# Altium schematic sheet SAM_E54_Xplained_Pro_TopLevel.SchDoc: Top Level Schematics
size A3; Organization: Microchip Norway; Address1: Vestre Rosten 79; Address2: N-7075 TILLER; Address3: NORWAY; DocumentNumber: A09-2748; Revision: 5; SheetNumber: 1; SheetTotal: 13; DrawnBy: Microchip Norway; Engineer: HN; PageSetup: Record=PageOptions|CenterHorizontal=True|CenterVertical=True|PrintScale=1.01|XCorrection=1.00|YCorrection=1.00|PrintKind=1|BorderSize=5000000|LeftOffset=0|BottomOffset=0|Orientation=2|PaperLength=1000|PaperWidth=1000|Scale=100|PaperSource=7|PrintQuality=-4|MediaType=1|DitherType=10|PaperKind=Letter|PrintScaleMode=1; PCBNumber: A08-2643; PCBRevision: 3; ProjectTitle: SAM E54 Xplained Pro; ProjectName: SAM E54 Xplained Pro
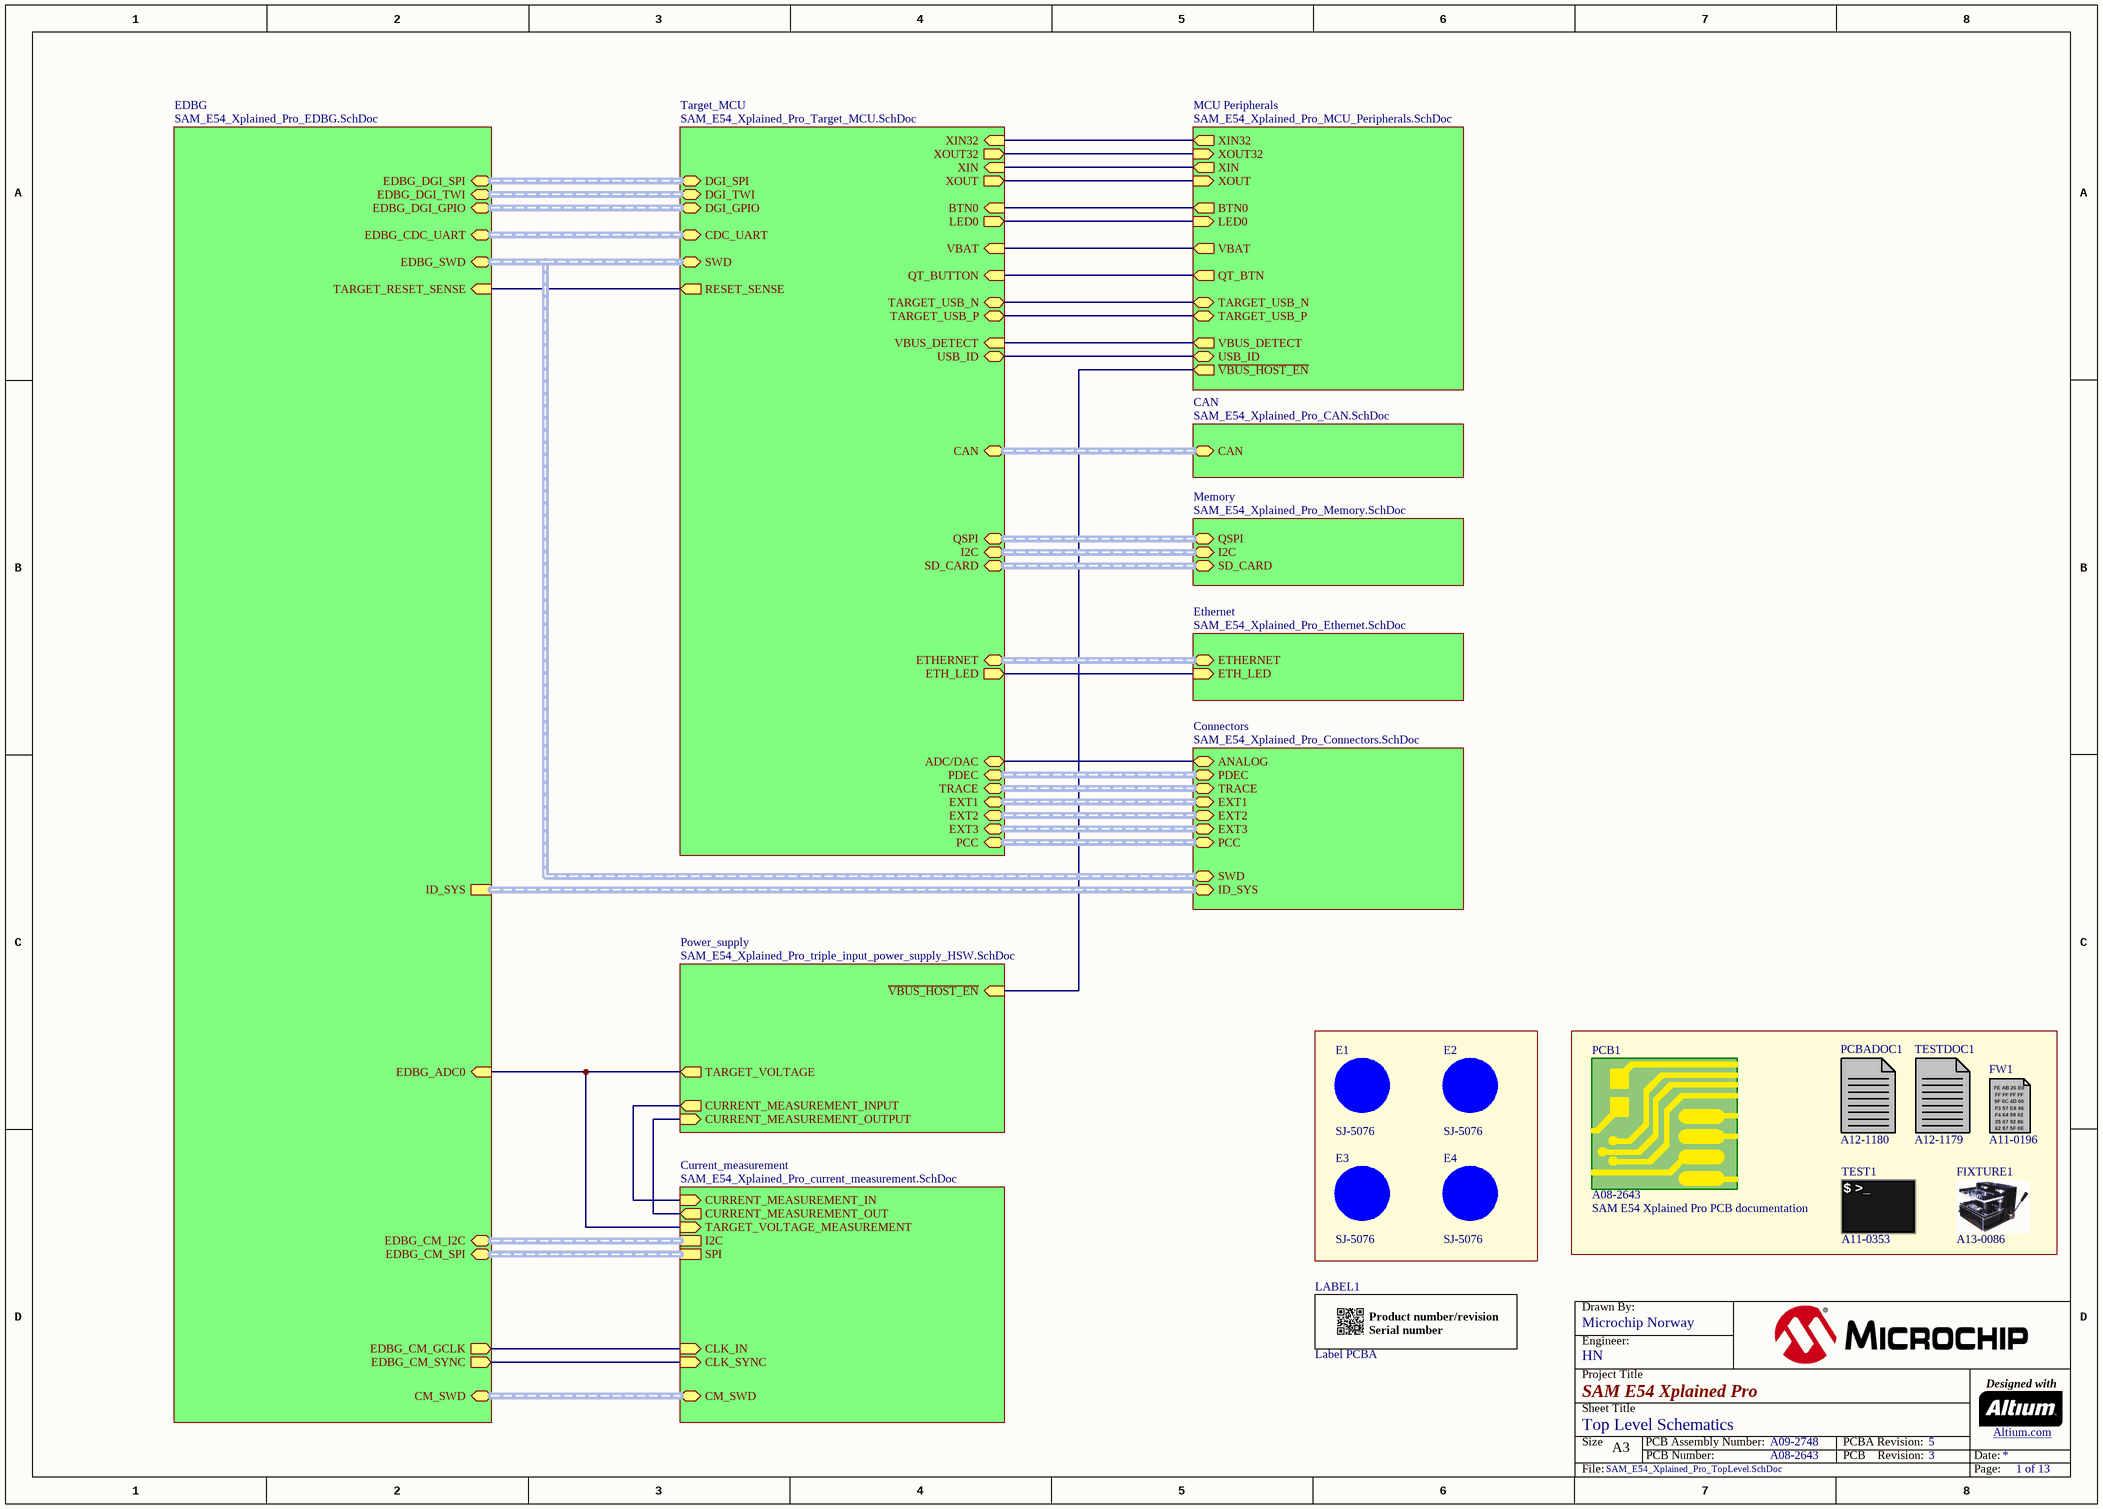
[diagram p0: SAM_E54_Xplained_Pro_TopLevel.SchDoc]

## Parts
E1  value SJ-5076  [AP8-00192]
E2  value SJ-5076  [AP8-00192]
E3  value SJ-5076  [AP8-00192]
E4  value SJ-5076  [AP8-00192]
FIXTURE1  AN: A13-0086  (mechanical)
FW1  AN: A11-0196  (mechanical)
LABEL1  value Label PCBA  [AP8-00317]  (hidden comment: *)
PCB1  value SAM E54 Xplained Pro PCB documentation  AN: A08-2643  (mechanical)
PCBADOC1  AN: A12-1180  (mechanical)
TEST1  AN: A11-0353  (mechanical)
TESTDOC1  AN: A12-1179  (mechanical)

## Sub-sheets
CAN = SAM_E54_Xplained_Pro_CAN.SchDoc: CAN (harness CAN)
Connectors = SAM_E54_Xplained_Pro_Connectors.SchDoc: EXT1 (harness EXT), EXT3 (harness EXT), SWD (harness SWD), ID_SYS (harness ID_SYS), EXT2 (harness EXT), TRACE (harness TRACE), PCC (harness PCC), PDEC (harness PDEC), ANALOG (bidir)
Current_measurement = SAM_E54_Xplained_Pro_current_measurement.SchDoc: I2C (harness I2C), SPI (harness SPI), CLK_IN (in), CLK_SYNC (in), CURRENT_MEASUREMENT_OUT (out), CURRENT_MEASUREMENT_IN (in), TARGET_VOLTAGE_MEASUREMENT (in), CM_SWD (harness SWD)
EDBG = SAM_E54_Xplained_Pro_EDBG.SchDoc: ID_SYS (harness ID_SYS), EDBG_CDC_UART (harness UART), EDBG_DGI_TWI (harness I2C), EDBG_DGI_SPI (harness SPI), TARGET_RESET_SENSE (in), EDBG_ADC0 (in), EDBG_CM_I2C (harness I2C), EDBG_CM_SPI (harness SPI), EDBG_CM_GCLK (out), EDBG_CM_SYNC (out), CM_SWD (harness SWD), EDBG_SWD (harness SWD), EDBG_DGI_GPIO (harness GPIO)
Ethernet = SAM_E54_Xplained_Pro_Ethernet.SchDoc: ETHERNET (harness ETHERNET), ETH_LED (in)
MCU Peripherals = SAM_E54_Xplained_Pro_MCU_Peripherals.SchDoc: VBUS_DETECT (out), XIN32 (out), XIN (out), XOUT32 (in), TARGET_USB_N (bidir), TARGET_USB_P (bidir), BTN0 (out), LED0 (in), XOUT (in), ~{VBUS_HOST_EN} (out), VBAT (out), USB_ID (bidir), QT_BTN (out)
Memory = SAM_E54_Xplained_Pro_Memory.SchDoc: QSPI (harness QSPI), I2C (harness I2C), SD_CARD (harness SD_CARD)
Power_supply = SAM_E54_Xplained_Pro_triple_input_power_supply_HSW.SchDoc: TARGET_VOLTAGE (out), CURRENT_MEASUREMENT_INPUT (out), CURRENT_MEASUREMENT_OUTPUT (in), ~{VBUS_HOST_EN} (in)
Target_MCU = SAM_E54_Xplained_Pro_Target_MCU.SchDoc: DGI_SPI (harness SPI), DGI_TWI (harness I2C), CDC_UART (harness UART), EXT3 (harness EXT), EXT1 (harness EXT), RESET_SENSE (out), SWD (harness SWD), EXT2 (harness EXT), CAN (harness CAN), QSPI (harness QSPI), I2C (harness I2C), SD_CARD (harness SD_CARD), ETHERNET (harness ETHERNET), VBUS_DETECT (in), XIN32 (in), XIN (in), XOUT32 (out), TARGET_USB_N (bidir), TARGET_USB_P (bidir), BTN0 (in), LED0 (out), XOUT (out), USB_ID (bidir), VBAT (in), TRACE (harness TRACE), PCC (harness PCC), ETH_LED (out), DGI_GPIO (harness GPIO), QT_BUTTON (in), PDEC (harness PDEC), ADC/DAC (bidir)

## Nets
(unnamed): sheet Target_MCU/RESET_SENSE, sheet EDBG/TARGET_RESET_SENSE
(unnamed): sheet Target_MCU/VBUS_DETECT, sheet MCU Peripherals/VBUS_DETECT
(unnamed): sheet Target_MCU/XIN32, sheet MCU Peripherals/XIN32
(unnamed): sheet Target_MCU/XIN, sheet MCU Peripherals/XIN
(unnamed): sheet Target_MCU/XOUT32, sheet MCU Peripherals/XOUT32
(unnamed): sheet Target_MCU/TARGET_USB_N, sheet MCU Peripherals/TARGET_USB_N
(unnamed): sheet Target_MCU/TARGET_USB_P, sheet MCU Peripherals/TARGET_USB_P
(unnamed): sheet Target_MCU/BTN0, sheet MCU Peripherals/BTN0
(unnamed): sheet Target_MCU/LED0, sheet MCU Peripherals/LED0
(unnamed): sheet Target_MCU/XOUT, sheet MCU Peripherals/XOUT
(unnamed): sheet Target_MCU/USB_ID, sheet MCU Peripherals/USB_ID
(unnamed): sheet Target_MCU/VBAT, sheet MCU Peripherals/VBAT
(unnamed): sheet Target_MCU/ETH_LED, sheet Ethernet/ETH_LED
(unnamed): sheet Target_MCU/QT_BUTTON, sheet MCU Peripherals/QT_BTN
(unnamed): sheet Target_MCU/ADC/DAC, sheet Connectors/ANALOG
(unnamed): sheet EDBG/EDBG_ADC0, sheet Power_supply/TARGET_VOLTAGE, sheet Current_measurement/TARGET_VOLTAGE_MEASUREMENT
(unnamed): sheet EDBG/EDBG_CM_GCLK, sheet Current_measurement/CLK_IN
(unnamed): sheet EDBG/EDBG_CM_SYNC, sheet Current_measurement/CLK_SYNC
(unnamed): sheet Power_supply/CURRENT_MEASUREMENT_INPUT, sheet Current_measurement/CURRENT_MEASUREMENT_IN
(unnamed): sheet Power_supply/CURRENT_MEASUREMENT_OUTPUT, sheet Current_measurement/CURRENT_MEASUREMENT_OUT
(unnamed): sheet Power_supply/~{VBUS_HOST_EN}, sheet MCU Peripherals/~{VBUS_HOST_EN}

Not connected (* = marked no-connect by the designer): E1 1(FIDUCIAL); E2 1(FIDUCIAL); E3 1(FIDUCIAL); E4 1(FIDUCIAL)

## Buses and harness runs
harness sheet CAN/CAN = sheet Target_MCU/CAN
harness sheet Connectors/EXT1 = sheet Target_MCU/EXT1
harness sheet Connectors/EXT2 = sheet Target_MCU/EXT2
harness sheet Connectors/EXT3 = sheet Target_MCU/EXT3
harness sheet Connectors/ID_SYS = sheet EDBG/ID_SYS
harness sheet Connectors/PCC = sheet Target_MCU/PCC
harness sheet Connectors/PDEC = sheet Target_MCU/PDEC
harness sheet Connectors/SWD = sheet EDBG/EDBG_SWD = sheet Target_MCU/SWD
harness sheet Connectors/TRACE = sheet Target_MCU/TRACE
harness sheet Current_measurement/CM_SWD = sheet EDBG/CM_SWD
harness sheet Current_measurement/I2C = sheet EDBG/EDBG_CM_I2C
harness sheet Current_measurement/SPI = sheet EDBG/EDBG_CM_SPI
harness sheet EDBG/EDBG_CDC_UART = sheet Target_MCU/CDC_UART
harness sheet EDBG/EDBG_DGI_GPIO = sheet Target_MCU/DGI_GPIO
harness sheet EDBG/EDBG_DGI_SPI = sheet Target_MCU/DGI_SPI
harness sheet EDBG/EDBG_DGI_TWI = sheet Target_MCU/DGI_TWI
harness sheet Ethernet/ETHERNET = sheet Target_MCU/ETHERNET
harness sheet Memory/I2C = sheet Target_MCU/I2C
harness sheet Memory/QSPI = sheet Target_MCU/QSPI
harness sheet Memory/SD_CARD = sheet Target_MCU/SD_CARD

## Notes on the sheet
- Drawn By:
- Project Title
- Engineer:
- Designed with
- Sheet Title
- Size
- A3
- PCB Number:
- PCB Assembly Number:
- PCBA Revision:
- PCB    Revision:
- Date:
- Altium.com <http://go.altium.com/MicrochipLandingPage_Evaluation.html>
- File:
- Page:
- (in symbol A09-0611) / Product number/revision / Serial number
- (in symbol A11-0196) FE AB 26 E0; FF FF FF FF; 9F 0C 4D 00; F3 57 E8 96; F4 64 98 02; 35 07 92 86; 62 87 5F 0E
- (in symbol A11-0353) $ >_

## Library data of the parts
E1-E4 = A08-0053: 2.8mm adhesive feet,diam 8.0mm; PartGroup: Mechanical devices,Mounting accessories; Manufacturer: 3M; AN: A08-0053; Height: 2,79999995231628; MPN: SJ-5076
FIXTURE1 = A13-0086: Xplained PRO MCU board Jupiter Test Fixture; PartGroup: Test Equipment,Test Fixtures; Manufacturer: ESCATEC; Value: Xplained PRO MCU board Jupiter Test Fixture; MPN: Xplained PRO MCU board Jupiter Test Fixture
FW1 = A11-0196: EDBG secured firmware; PartGroup: Software,Firmware,Tools; Manufacturer: ATMEL; Value: EDBG secured firmware
LABEL1 = A09-0611: PCBA identification label PP Top White Gloss; PartGroup: Mechanical devices,Packaging materials,Printed Labels; Manufacturer: ACT Logimark AS; MPN: 505462; AN: A09-0611
PCB1 = A08-2643: SAM E54 Xplained Pro PCB documentation; PartGroup: Mechanical devices,Printed circuit boards
PCBADOC1 = A12-1180: SAM E54 Xplained Pro PCBA documentation; PartGroup: Documentation,PCBA Documents,Atmel; Value: SAM E54 Xplained Pro PCBA documentation
TEST1 = A11-0353: SAM E54 Xplained Pro eggTest; PartGroup: Software,Test software,Tools; Value: SAM E54 Xplained Pro eggTest
TESTDOC1 = A12-1179: SAM E54 Xplained Pro Test Instructions; PartGroup: Documentation,Procedures,Test Instructions; Value: SAM E54 Xplained Pro Test Instructions